# EAGLE design ShifterControl (EAGLE 9.6.2)
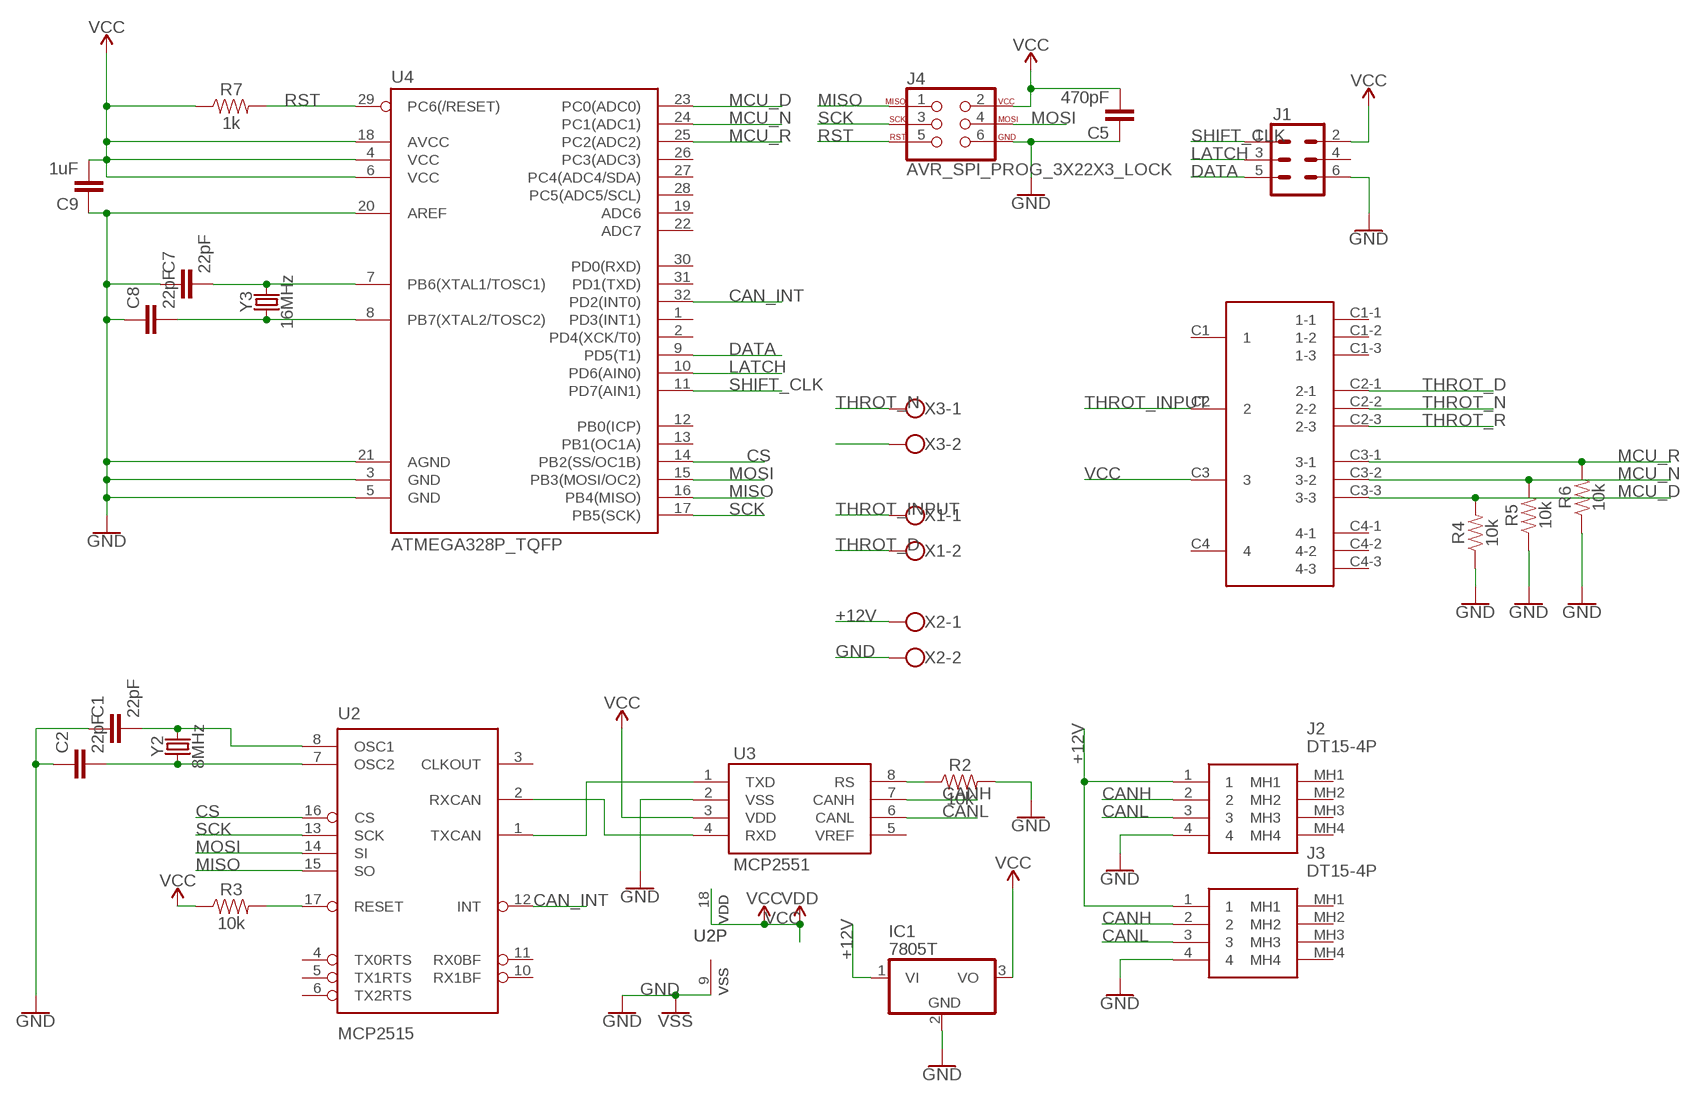
[diagram p0: schematic, sheet 1]

## Parts
C1  22pF  22PF-0603-50V-5%  [0603]
C2  22pF  22PF-0603-50V-5%  [0603]
C5  470pF  22PF-0603-50V-5%  [0603]
C7  22pF  22PF-0603-50V-5%  [0603]
C8  22pF  22PF-0603-50V-5%  [0603]
C9  1uF  22PF-0603-50V-5%  [0603]
IC1  7805T  [TO220H]
J1  CONN_03X2SHROUD  [2X3-SHROUDED]
J2  DT15-4P  [DT154P]
J3  DT15-4P  [DT154P]
J4  AVR_SPI_PROG_3X22X3_LOCK  [2X3_LOCK]
R2  10k  1KOHM-0603-1/10W-1%  [0603]
R3  10k  1KOHM-0603-1/10W-1%  [0603]
R4  10k  1KOHM-0603-1/10W-1%  [0603]
R5  10k  1KOHM-0603-1/10W-1%  [0603]
R6  10k  1KOHM-0603-1/10W-1%  [0603]
R7  1k  1KOHM-0603-1/10W-1%  [0603]
U2  MCP2515  MCP2515(MCP2510)SO  [SO18W]
U3  MCP2551  [SO08]
U4  ATMEGA328P_TQFP  [TQFP32-08]
U$1  SR2511F-3  [SR2511F-3]
X1  W237-102  [W237-102]
X2  W237-102  [W237-102]
X3  W237-102  [W237-102]
Y2  8MHz  CRYSTAL-8MHZSMD-HC49UP  [HC49UP]
Y3  16MHz  CRYSTAL-8MHZSMD-HC49UP  [HC49UP]

## Nets
+12V: IC1.1(VI) J2.1 J3.1 X2.1
CAN_INT: U2.12(INT) U4.32(PD2(INT0))
CANH: J2.2 J3.2 U3.7(CANH)
CANL: J2.3 J3.3 U3.6(CANL)
CS: U2.16(CS) U4.14(PB2(SS/OC1B))
DATA: J1.5 U4.9(PD5(T1))
GND: C1.1 C2.1 C5.1 C7.1 C8.1 C9.1 IC1.2(GND) J1.6 J2.4 J3.4 J4.6 R2.2 R4.1 R5.1 R6.1 U2.9(VSS) U3.2(VSS) U4.3(GND) U4.5(GND) U4.20(AREF) U4.21(AGND) X2.2 ; supply symbol labelled VSS
LATCH: J1.3 U4.10(PD6(AIN0))
MCU_D: R4.2 U4.23(PC0(ADC0)) U$1.C3-3(3-3)
MCU_N: R5.2 U4.24(PC1(ADC1)) U$1.C3-2(3-2)
MCU_R: R6.2 U4.25(PC2(ADC2)) U$1.C3-1(3-1)
MISO: J4.1 U2.15(SO) U4.16(PB4(MISO))
MOSI: J4.4 U2.14(SI) U4.15(PB3(MOSI/OC2))
N$1: U2.1(TXCAN) U3.1(TXD)
N$2: U2.2(RXCAN) U3.4(RXD)
N$3: C2.2 U2.7(OSC2) Y2.1
N$4: C1.2 U2.8(OSC1) Y2.2
N$7: R2.1 U3.8(RS)
N$8: R3.2 U2.17(RESET)
N$9: C8.2 U4.8(PB7(XTAL2/TOSC2)) Y3.1
N$10: C7.2 U4.7(PB6(XTAL1/TOSC1)) Y3.2
RST: J4.5 R7.2 U4.29(PC6(/RESET))
SCK: J4.3 U2.13(SCK) U4.17(PB5(SCK))
SHIFT_CLK: J1.1 U4.11(PD7(AIN1))
THROT_D: U$1.C2-1(2-1) X1.2
THROT_INPUT: U$1.C2 X1.1
THROT_N: U$1.C2-2(2-2) X3.1
THROT_R: U$1.C2-3(2-3) X3.2
VCC: C5.2 C9.2 IC1.3(VO) J1.2 J4.2 R3.1 R7.1 U2.18(VDD) U3.3(VDD) U4.4(VCC) U4.6(VCC) U4.18(AVCC) U$1.C3 ; supply symbol labelled VDD
Unconnected: J1.4 J2.MH1 J2.MH2 J2.MH3 J2.MH4 J3.MH1 J3.MH2 J3.MH3 J3.MH4 U2.3(CLKOUT) U2.4(TX0RTS) U2.5(TX1RTS) U2.6(TX2RTS) U2.10(RX1BF) U2.11(RX0BF) U3.5(VREF) U4.1(PD3(INT1)) U4.2(PD4(XCK/T0)) U4.12(PB0(ICP)) U4.13(PB1(OC1A)) U4.19(ADC6) U4.22(ADC7) U4.26(PC3(ADC3)) U4.27(PC4(ADC4/SDA)) U4.28(PC5(ADC5/SCL)) U4.30(PD0(RXD)) U4.31(PD1(TXD)) U$1.C1 U$1.C1-1(1-1) U$1.C1-2(1-2) U$1.C1-3(1-3) U$1.C4 U$1.C4-1(4-1) U$1.C4-2(4-2) U$1.C4-3(4-3)

## Library data of the parts
C1 C2 C7 C8 = SparkFun-Capacitors:22PF: 22pF ceramic capacitors A capacitor is a passive two-terminal electrical component used to store electrical energy temporarily in an electric field.; PROD_ID: CAP-07876
C5 C9 = SparkFun-Capacitors:22PF: 22pF ceramic capacitors A capacitor is a passive two-terminal electrical component used to store electrical energy temporarily in an electric field.; PROD_ID: CAP-07876; VALUE: 22pF
IC1 = linear:78*: Positive VOLTAGE REGULATOR Source: http://cache.national.com/ds/LM/LM78L05.pdf http://www.fairchildsemi.com/ds/LM/LM7805.pdf
J1 = SparkFun-Connectors:CONN_03X2: Multi connection point. Often used as Generic Header-pin footprint for 0.1 inch spaced/style header connections You can populate with any combo of single row headers, but if you'd like an exact match, check these: Header - 2x3 (Male, 0.1") <https://www.sparkfun.com/products/12807> (PRT-12807) Header - 2x3 (Female, 0.1") <https://www.sparkfun.com/products/13010> (PRT-13010) 2x3 Pin Shrouded Header <https://www.sparkfun.com/products/10877> (PRT-10877) On any of the 0.1 inch spaced packages, you can populate with these: Break Away Headers - Straight <https://www.sparkfun.com/products/116> (PRT-00116) Break Away Male Headers - Right Angle <https://www.sparkfun.com/products/553> (PRT-00553) Female Headers <https://www.sparkfun.com/products/115> (PRT-00115) Break Away Headers - Machine Pin <https://www.sparkfun.com/products/117> (PRT-00117) Break Away Female Headers - Swiss Machine Pin <https://www.sparkfun.com/products/743> (PRT-00743) Special note: the shrouded connector mates well with our 3x2 ribbon cables: Ribbon Crimp Connector - 6-pin (2x3, Female) <https://www.sparkfun.com/products/10651> (PRT-10651) Ribbon Cable - 6 wire (15ft) <https://www.sparkfun.com/products/10646> (PRT-10646); PROD_ID: CONN-10681; SF_ID: PRT_10877
J2 J3 = DT15-4P:DT15-4P: Deutsch DT15 Series, 4.44mm Pitch 4 Way 2 Row Straight PCB Header, Solder Termination Source: Datasheet <https://www.te.com/commerce/DocumentDelivery/DDEController?Action=showdoc&DocId=Customer DrawingDT15-4PD2pdfEnglishENG_CD_DT15-4P_D2.pdfDT15-4P>; DESCRIPTION: Deutsch DT15 Series, 4.44mm Pitch 4 Way 2 Row Straight PCB Header, Solder Termination; HEIGHT: 30.35mm; MANUFACTURER_NAME: TE Connectivity; MANUFACTURER_PART_NUMBER: DT15-4P; MOUSER_PART_NUMBER: 571-DT15-4P; MOUSER_PRICE-STOCK: https://www.mouser.co.uk/ProductDetail/TE-Connectivity-DEUTSCH/DT15-4P?qs=vkMqrgFpRajtjo1r4fVe%2Fw%3D%3D
J4 = SparkFun-Connectors:AVR_SPI_PROG_3X2: AVR ISP 6 Pin This is the reduced ISP connector for AVR programming. Common on Arduino. This footprint will take up less PCB space and can be used with a 10-pin to 6-pin adapter such as SKU: BOB-08508 **Special note about "TEST_POINT" package. The stop mask is on the top side, so if you want your programming test points to be on the bottom of your board, make sure to place this package on the bottom side of the board. This also ensure that the orientation to program from the bottom side will be correct. SparkFun Products: SparkFun ISP Pogo Adapter <https://www.sparkfun.com/products/11591> - NS Tiny AVR Programmer <https://www.sparkfun.com/products/11801> -PTH
R2-R6 = SparkFun-Resistors:1KOHM: 1kΩ resistor A resistor is a passive two-terminal electrical component that implements electrical resistance as a circuit element. Resistors act to reduce current flow, and, at the same time, act to lower voltage levels within circuits. - Wikipedia; PROD_ID: RES-07856; VALUE: 1k
R7 = SparkFun-Resistors:1KOHM: 1kΩ resistor A resistor is a passive two-terminal electrical component that implements electrical resistance as a circuit element. Resistors act to reduce current flow, and, at the same time, act to lower voltage levels within circuits. - Wikipedia; PROD_ID: RES-07856
U2 = SparkFun-IC-Comms:MCP2515(MCP2510): CAN controller with SPI interface The MCP2515 controller supercedes the MCP2510 while addressing all errata associated with it. The two devices are pin compatible, either can be used with this device. 18-pin package SOIC Simple SPI interface to any MCU. One-shot mode ensures message transmission is attempted only once Databyte filtering Start-of-Frame (SOF) output Low-power CMOS Technology Datasheet <http://www.sparkfun.com/datasheets/DevTools/Arduino/MCP2515.pdf> SparkFun Products CAN-BUS Shield <https://www.sparkfun.com/products/13262> (DEV-13262); PROD_ID: IC-09906
U3 = SparkFun-IC-Comms:MCP2551: MCP2551 High Speed CAN Transceiver High speed CAN transceiver Datasheet <http://www.sparkfun.com/datasheets/DevTools/Arduino/MCP2551.pdf> SparkFun Products CAN-BUS Shield <https://www.sparkfun.com/products/13262> (DEV-13262) SparkFun OBD-II UART <https://www.sparkfun.com/products/9555> (WIG-09555); PROD_ID: IC-09907
U4 = SparkFun-IC-Microcontroller:ATMEGA328P_TQFP: Popular 328P in QFP Storefront component: ATmega328 - TQFP <https://www.sparkfun.com/products/13448> (COM-13448) Datasheet <http://www.sparkfun.com/datasheets/Components/SMD/ATMega328.pdf> SparkFun Products SparkFun RedBoard - Programmed with Arduino <https://www.sparkfun.com/products/12757> (DEV-12757) Arduino Pro Mini 328 - 5V/16MHz <https://www.sparkfun.com/products/11113> (DEV-11113) Arduino Pro Mini 328 - 3.3V/8MHz <https://www.sparkfun.com/products/11114> (DEV-11114) SparkFun OpenLog <https://www.sparkfun.com/products/13712> (DEV-13712) SparkFun MicroView - OLED Arduino Module <https://www.sparkfun.com/products/12923> (DEV-12923) SparkFun Digital Sandbox <https://www.sparkfun.com/products/12651> (DEV-12651) SparkFun PicoBoard <https://www.sparkfun.com/products/11888> (WIG-11888) Arduino Fio <https://www.sparkfun.com/products/10116> (DEV-10116) LilyPad Arduino 328 Main Board <https://www.sparkfun.com/products/13342> (DEV-13342) SparkFun RedStick <https://www.sparkfun.com/products/13741> (DEV-13741) LilyPad MP3 <https://www.sparkfun.com/products/11013> (DEV-11013) LilyPad Arduino SimpleSnap <https://www.sparkfun.com/products/10941> (DEV-10941) SparkFun Stepoko <https://www.sparkfun.com/products/13899> (ROB-13899) SparkFun Geiger Counter <https://www.sparkfun.com/products/11345> (SEN-11345) SparkFun EL Sequencer <https://www.sparkfun.com/products/12781> (COM-12781) Arduino Pro 328 - 5V/16MHz <https://www.sparkfun.com/products/10915> (DEV-10915) CryptoCape <https://www.sparkfun.com/products/12773> (DEV-12773) SparkFun IR Thermometer Evaluation Board - MLX90614 <https://www.sparkfun.com/products/10740> (SEN-10740) SparkFun RedBot Mainboard <https://www.sparkfun.com/products/12097> (ROB-12097) Arduino Pro 328 - 3.3V/8MHz <https://www.sparkfun.com/products/10914> (DEV-10914) SparkFun Block for Intel® Edison - Arduino <https://www.sparkfun.com/products/13036> (DEV-13036) SparkFun Simon Says - Surface Mount Soldering Kit <https://www.sparkfun.com/products/10935> (KIT-10935) SparkFun 7-Segment Serial Display - Red <https://www.sparkfun.com/products/11441> (COM-11441) SparkFun 7-Segment Serial Display - White <https://www.sparkfun.com/products/11629> (COM-11629) SparkFun 7-Segment Serial Display - Yellow <https://www.sparkfun.com/products/11443> (COM-11443) SparkFun 7-Segment Serial Display - Kelly Green <https://www.sparkfun.com/products/11440> (COM-11440) SparkFun 7-Segment Serial Display - Blue <https://www.sparkfun.com/products/11442> (COM-11442) SparkFun OpenSegment Serial Display - 20mm (Blue) <https://www.sparkfun.com/products/11647> (COM-11647) SparkFun OpenSegment Serial Display - 20mm (Green) <https://www.sparkfun.com/products/11646> (COM-11646) SparkFun OpenSegment Serial Display - 20mm (White) <https://www.sparkfun.com/products/11648> (COM-11648) SparkFun OpenSegment Serial Display - 20mm (Red) <https://www.sparkfun.com/products/11644> (COM-11644) SparkFun OpenSegment Serial Display - 20mm (Yellow) <https://www.sparkfun.com/products/11645> (COM-11645) SparkFun OpenSegment Shield <https://www.sparkfun.com/products/13190> (DEV-13190); PROD_ID: IC-09069
U$1 = SR2511:SR2511F-3
X1-X3 = con-wago-500:W237-102: WAGO SCREW CLAMP; MPN: 237-102; OC_FARNELL: unknown; OC_NEWARK: 70K9898
Y2 = SparkFun-Clocks:CRYSTAL-8MHZ: 8MHz Crystal Datasheet Example <http://www.futureelectronics.com/en/technologies/electromechanical/timing-devices/crystals/Pages/6008189-ABM3B-8.000MHZ-B2-T.aspx?IM=0> Frequency: 8MHz Frequency Tolerance: ±20ppm Load Capacitance: 18pF SparkFun Products: Pro Micro -3.3V/8MHz <https://www.sparkfun.com/products/12587> WAV Trigger <https://www.sparkfun.com/products/13660>; PROD_ID: XTAL-11706
Y3 = SparkFun-Clocks:CRYSTAL-8MHZ: 8MHz Crystal Datasheet Example <http://www.futureelectronics.com/en/technologies/electromechanical/timing-devices/crystals/Pages/6008189-ABM3B-8.000MHZ-B2-T.aspx?IM=0> Frequency: 8MHz Frequency Tolerance: ±20ppm Load Capacitance: 18pF SparkFun Products: Pro Micro -3.3V/8MHz <https://www.sparkfun.com/products/12587> WAV Trigger <https://www.sparkfun.com/products/13660>; PROD_ID: XTAL-11706; VALUE: 8MHz

## Net classes
0 default: width 0.305 mm

## Board
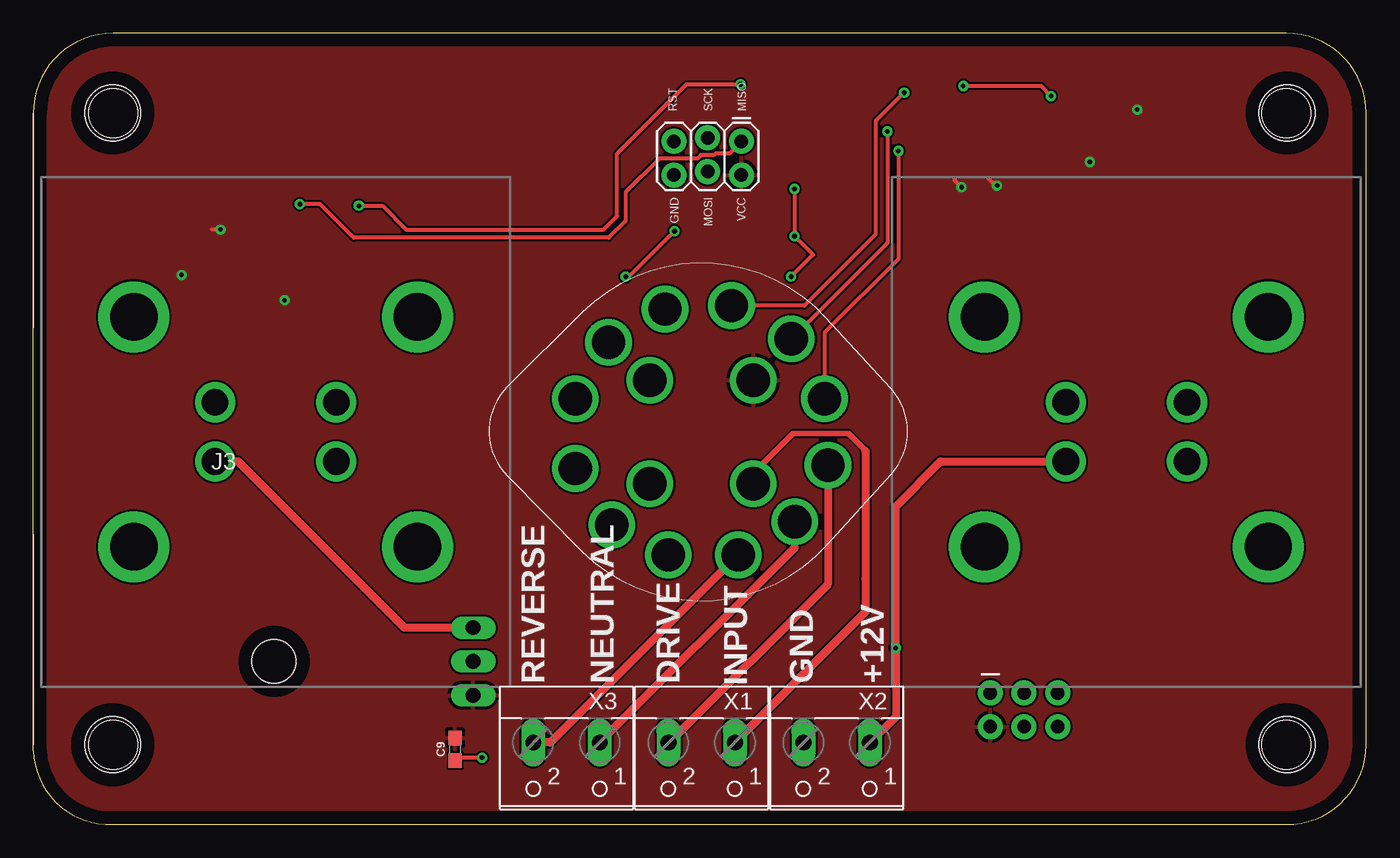
[diagram p1: board, top side]
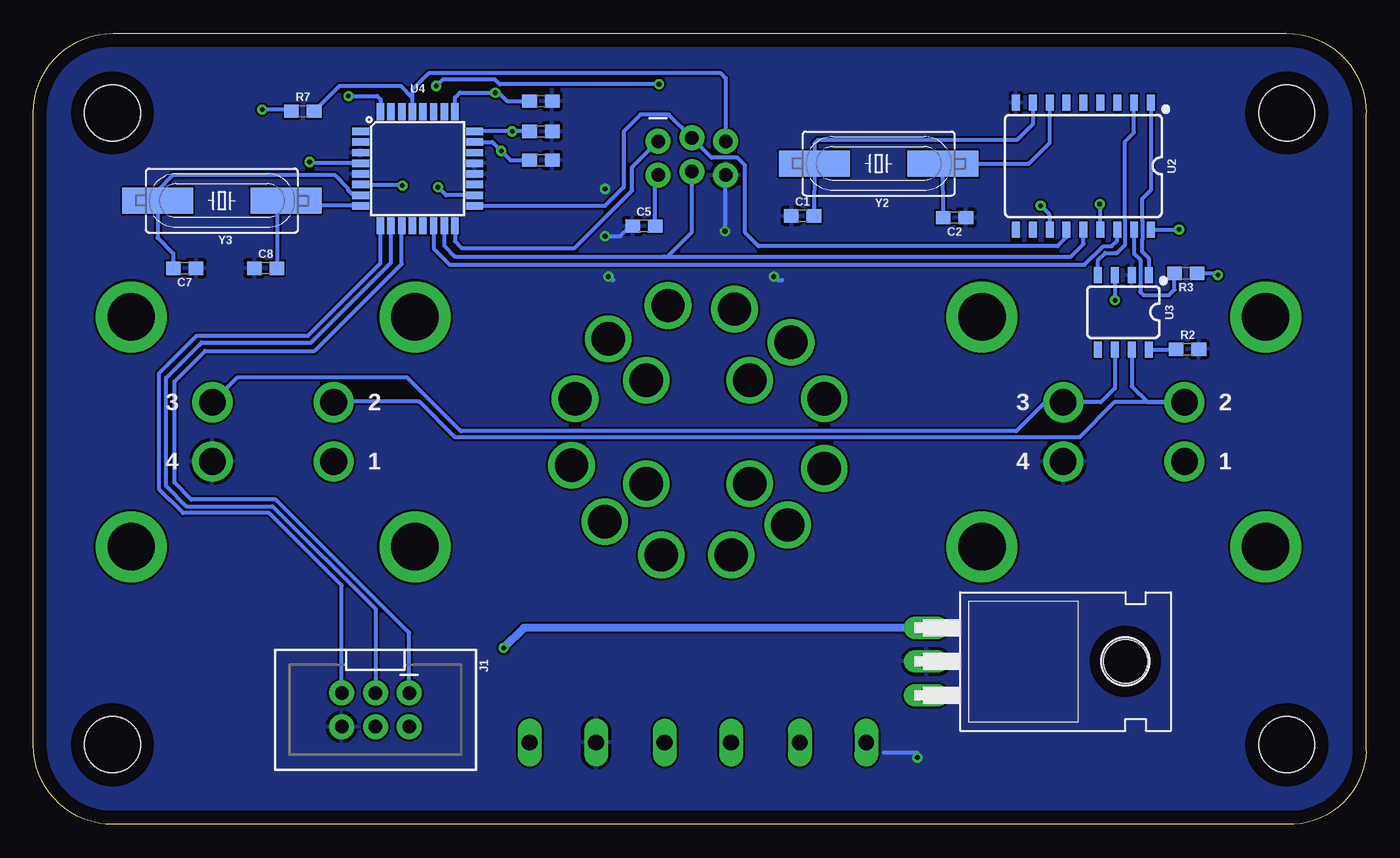
[diagram p2: board, bottom side, seen from below]

Size 100.28 x 59.54 mm. Coordinates in mm from the lower left corner, seen from the top.
Outline: 94.28,0 arc90 100.28,6 100.28,53.54 arc90 94.28,59.54 6,59.54 arc90 0,53.54 0,5.54 arc90 6,0 94.28,0
Copper layers (1*16): Top 0.035mm / dielectric 1.5mm / Bottom 0.035mm
Design rules "default": minimum track width 6mil, minimum drill 0.35mm, track to track 6mil, track to pad 6mil, pad to pad 6mil, via to via 6mil, smd to smd 6mil, copper to edge 40mil, drill to drill 6mil, minimum pad ring 10mil, minimum via ring 8mil, stop-mask expansion 4mil, vias tented up to drill 0mil, thermal gap 10mil
Holes 4.2 mm at 94.31,6.01 5.98,6.01 94.31,53.54 5.98,53.54

### Footprints (pad centres in the part's own frame; a part is rotated, then mirrored left to right if it is on the bottom)
0603 = smd 1.1 x 1: 1 -0.85,0; 2 0.85,0
TO220H = drill 1.118 long: 1 -2.54,-10.16; 2 0,-10.16; 3 2.54,-10.16 | hole 3.302: 0,4.826
2X3-SHROUDED = drill 1.016 pad 1.88: 1 -1.27,2.54; 2 1.27,2.54; 3 -1.27,0; 4 1.27,0; 5 -1.27,-2.54; 6 1.27,-2.54
DT154P = drill 2.01 pad 3.015: 1 4.599,2.215; 2 4.599,-2.235; 3 -4.521,-2.235; 4 -4.521,2.215 | drill 3.56 pad 5.34: MH1 -10.631,-8.66; MH2 -10.631,8.64; MH3 10.709,8.64; MH4 10.709,-8.66
2X3_LOCK = drill 1.016 pad 1.88: 1 0,0.127; 2 0,2.667; 3 2.54,-0.127; 4 2.54,2.413; 5 5.08,0.127; 6 5.08,2.667
SO18W = smd 0.6 x 1.2: 1 -5.08,-4.788; 2 -3.81,-4.788; 3 -2.54,-4.788; 4 -1.27,-4.788; 5 0,-4.788; 6 1.27,-4.788; 7 2.54,-4.788; 8 3.81,-4.788; 9 5.08,-4.788; 10 5.08,4.788; 11 3.81,4.788; 12 2.54,4.788; 13 1.27,4.788; 14 0,4.788; 15 -1.27,4.788; 16 -2.54,4.788; 17 -3.81,4.788; 18 -5.08,4.788
SO08 = smd 0.6 x 1.2: 1 -1.905,-2.8; 2 -0.635,-2.8; 3 0.635,-2.8; 4 1.905,-2.8; 5 1.905,2.8; 6 0.635,2.8; 7 -0.635,2.8; 8 -1.905,2.8
TQFP32-08 = smd 1.27 x 0.559: 1 -4.293,2.8; 2 -4.293,2; 3 -4.293,1.2; 4 -4.293,0.4; 5 -4.293,-0.4; 6 -4.293,-1.2; 7 -4.293,-2; 8 -4.293,-2.8; 17 4.293,-2.8; 18 4.293,-2; 19 4.293,-1.2; 20 4.293,-0.4; 21 4.293,0.4; 22 4.293,1.2; 23 4.293,2; 24 4.293,2.8 | smd 0.559 x 1.27: 9 -2.8,-4.293; 10 -2,-4.293; 11 -1.2,-4.293; 12 -0.4,-4.293; 13 0.4,-4.293; 14 1.2,-4.293; 15 2,-4.293; 16 2.8,-4.293; 25 2.8,4.293; 26 2,4.293; 27 1.2,4.293; 28 0.4,4.293; 29 -0.4,4.293; 30 -1.2,4.293; 31 -2,4.293; 32 -2.8,4.293
SR2511F-3 = drill 2.5: C1 3.889,3.889; C1-1 2.5,9.25; C1-2 6.75,7; C1-3 9.5,2.75; C2 -3.889,3.889; C2-1 -9.5,2.5; C2-2 -7,6.75; C2-3 -2.75,9.25; C3 -3.889,-3.889; C3-1 -2.25,-9.5; C3-2 -6.75,-7; C3-3 -9.25,-2.5; C4 3.889,-3.889; C4-1 9.5,-2.5; C4-2 7,-6.75; C4-3 2.75,-9.25
W237-102 = drill 1.194 long: 1 -2.5,-1.27; 2 2.5,-1.27
HC49UP = smd 5.334 x 1.93: 1 -4.826,0; 2 4.826,0

### Placement (x,y rotation side)
C1  42.4,45.79 0 bottom
C2  30.97,45.67 180 bottom
C5  54.34,45.03 0 bottom
C7  88.88,41.86 180 bottom
C8  82.79,41.86 0 bottom
C9  31.73,5.66 90 top
IC1  22.94,12.27 270 bottom
J1  74.54,8.63 270 bottom
J2  82.28,29.54 180 top
J3  18.28,29.54 180 top
J4  53.28,51.54 180 top
R2  13.45,35.76 0 bottom
R3  13.57,41.47 180 bottom
R4  62.09,49.98 180 bottom
R5  62.09,52.14 180 bottom
R6  62.09,54.43 180 bottom
R7  79.99,53.67 0 bottom
U2  21.28,49.54 180 bottom
U3  18.28,38.54 180 bottom
U4  71.36,49.35 0 bottom
U$1  50.28,29.54 180 top
X1  50.28,4.9 180 top
X2  60.44,4.9 180 top
X3  40.12,4.9 180 top
Y2  36.69,49.73 180 bottom
Y3  86.09,46.94 180 bottom

### Tracks (layer width: path | path; a pad name or v marks a point on that pad's centre or on a via)
+12V  (via drill 0.35)
  Top 0.61: 33.6,15.31 IC1.1 27.92,14.81 15.41,27.32 J3.1 | X2.1 64.88,8.11 v64.88,13.28 64.88,23.95 68.25,27.32 J2.1
  Top 0.635: J2.1 77.35,27 | 13.06,26.71 J3.1
  Bottom 0.61: IC1.1 63.35,14.81 v64.88,13.28
CAN_INT  (via drill 0.35)
  Top 0.305: v24.49,46.55 26.27,46.55 28.05,44.78 42.91,44.78 43.93,45.79 43.93,50.49 49.13,55.7 v53.2,55.7 | v69.96,55.57 75.8,55.57 v76.56,54.81
  Bottom 0.305: U2.12 23.82,45.88 v24.49,46.55 | v53.2,55.7 65.18,55.7 65.54,56.05 69.48,56.05 v69.96,55.57 | U4.32 74.16,54.56 74.41,54.81 v76.56,54.81
CANH
  Bottom 0.305: U3.7 17.64,32.97 16.44,31.77 J3.2 18.95,31.77 21.58,29.14 68.54,29.14 71.23,31.82 77.63,31.82 J2.2
CANL
  Bottom 0.305: U3.6 18.91,32.83 19.97,31.77 J3.3 24.15,31.77 26.33,29.59 68.11,29.59 72.14,33.63 84.94,33.63 J2.3
CS
  Bottom 0.305: U4.14 70.16,43.32 68.94,42.11 21.19,42.11 19.8,43.51 19.16,43.51 18.74,43.93 U2.16
DATA
  Bottom 0.305: J1.5 77.08,17.98 82.53,23.44 89.01,23.44 90.79,25.22 90.79,33.98 87.99,36.78 79.61,36.78 74.16,42.23 U4.9
GND  (via drill 0.35)
  Top 0.305: v57.26,47.82 v57.26,44.27 58.66,42.87 v57.01,41.22 | v48.24,44.65 44.81,41.22 v44.56,41.22 | v33.77,5.03 31.95,5.03 C9.1
  Bottom 0.305: J4.6 48.2,44.7 v48.24,44.65 | v57.26,44.27 56.12,44.27 55.23,45.16 | v57.01,41.22 56.75,40.97 56.63,40.97 | v44.56,41.22 44.31,40.97 43.93,40.97 | v33.77,5.03 33.77,5.41 36.31,5.41
  pour Bottom: 99.81,61.29 99.81,0.33 0.75,0.33 0.75,61.29
LATCH
  Bottom 0.305: J1.3 74.54,16.2 82.28,23.95 88.76,23.95 90.28,25.47 90.28,33.6 87.61,36.27 79.36,36.27 73.36,42.27 U4.10
MCU_D  (via drill 0.35)
  Top 0.305: v65.07,50.68 65.07,42.55 59.53,37.01 U$1.C3-3
  Bottom 0.305: U4.23 65.74,51.35 v65.07,50.68 64.37,49.98 R4.2
MCU_N  (via drill 0.35)
  Top 0.305: v64.25,52.15 64.25,43.76 U$1.C3-2
  Bottom 0.305: R5.2 v64.25,52.15 U4.24
MCU_R  (via drill 0.35)
  Top 0.305: v65.52,55.06 63.36,52.9 63.36,44.4 58,39.04 U$1.C3-1
  Bottom 0.305: U4.25 68.56,54.69 68.18,55.06 v65.52,55.06 65.26,55.06 64.63,54.43 R6.2
MISO  (via drill 0.35)
  Top 0.305: J4.1 52.36,50.49 51.32,50.49 51.2,50.37 50.22,50.37 49.97,50.11 47.1,50.11 44.56,47.57 44.56,45.41 43.29,44.14 24.11,44.14 21.57,46.68 v20.05,46.68
  Bottom 0.305: U4.16 68.56,43.88 68.06,43.38 59.55,43.38 55.23,47.7 55.23,49.46 J4.1 | v20.05,46.68 20.05,44.79 U2.15
MOSI
  Bottom 0.305: U4.15 69.36,43.54 68.56,42.74 52.82,42.74 52.56,42.74 | J4.4 50.74,44.57 52.56,42.74 | U2.14 21.28,43.68 22.21,42.74 52.56,42.74
N$1
  Bottom 0.305: U2.1 16.2,47.74 16.87,47.06 16.87,45.49 16.86,45.47 16.86,44.02 16.87,44.01 16.87,43.13 16.37,42.62 U3.1
N$2
  Bottom 0.305: U2.2 17.47,52.06 18.14,51.38 18.14,45.49 18.13,45.47 18.13,43.65 18.78,43 19.65,43 20.18,42.46 U3.4
N$3
  Bottom 0.305: U2.7 23.82,51.3 25.38,49.73 Y2.1 C2.2
N$4
  Bottom 0.305: U2.8 25.09,52.69 26.27,51.51 41.26,51.51 41.51,51.25 Y2.2 C1.2
N$7
  Bottom 0.305: U3.8 14.32,35.74 R2.1
N$8
  Bottom 0.305: U2.17 17.47,42.95 17,42.49 17,40.08 16.75,39.82 14.84,39.82 14.42,40.24 R3.2
N$9
  Bottom 0.305: U4.8 80.88,46.55 Y3.1 81.94,46.26 C8.2
N$10
  Bottom 0.305: U4.7 76.2,47.35 76.59,47.74 76.59,47.85 77.58,48.84 89.77,48.84 90.92,47.7 Y3.2 90.92,44.14 89.73,42.96 C7.2
RST
  Bottom 0.305: J4.5 48.2,56.16 48.55,56.51 70.54,56.51 71.76,55.3 71.76,54.7 | R7.2 77.24,55.57 72.63,55.57 71.76,54.7 | 71.76,54.7 U4.29
SCK
  Bottom 0.305: U2.13 22.55,44.19 23.22,43.51 45.7,43.51 46.72,44.52 46.72,49.6 47.28,50.16 49.24,50.16 J4.3 52.48,53.41 54.59,53.41 55.86,52.14 55.86,47.95 57.27,46.55 U4.17
SHIFT_CLK
  Bottom 0.305: J1.1 72,14.43 82.03,24.46 88.38,24.46 89.65,25.73 89.65,33.35 87.36,35.63 79.1,35.63 72.56,42.18 U4.11 72.63,44.99
THROT_D
  Top 0.305: 47.9,6.21 47.9,6.3 X1.2
  Top 0.61: U$1.C2-1 59.78,18.08 47.9,6.21
THROT_INPUT
  Top 0.406: U$1.C2 54.16,26.44 57.13,29.41 61.32,29.41 62.59,28.14
  Top 0.61: 62.59,28.14 62.59,18.49 62.59,15.99 X1.1
THROT_N
  Top 0.305: 57.28,20.83 57.28,22.42
  Top 0.406: 57.28,22.42 U$1.C2-2
  Top 0.61: X3.1 57.28,20.83
THROT_R
  Top 0.61: U$1.C2-3 38.91,6.17 X3.2
VCC  (via drill 0.35)
  Top 0.305: v14.08,44.78 13.45,44.78 | v72.5,48.08 72.37,48.08 71.87,48.59 | v69.83,47.95 69.33,48.46 69.33,48.59 | v83.04,53.79 83.17,53.79 83.3,53.67
  Bottom 0.305: U2.18 14.11,44.75 v14.08,44.78 | U3.3 v18.91,39.44 | R3.1 11.29,41.47 v11.16,41.35 | C5.2 53.49,48.66 J4.2 | U4.4 79.38,49.75 v79.49,49.86 | U4.6 72.57,48.15 v72.5,48.08 | U4.18 69.23,47.35 v69.83,47.95 | R7.1 80.97,53.79 v83.04,53.79
  pour Top: 99.81,0.33 -0.52,0.33 -0.52,60.02 103.62,60.02 103.62,4.14

### Text on the board
tPlace: RST | SCK | MISO | GND | MOSI | VCC | REVERSE | NEUTRAL | DRIVE | INPUT | GND | +12V